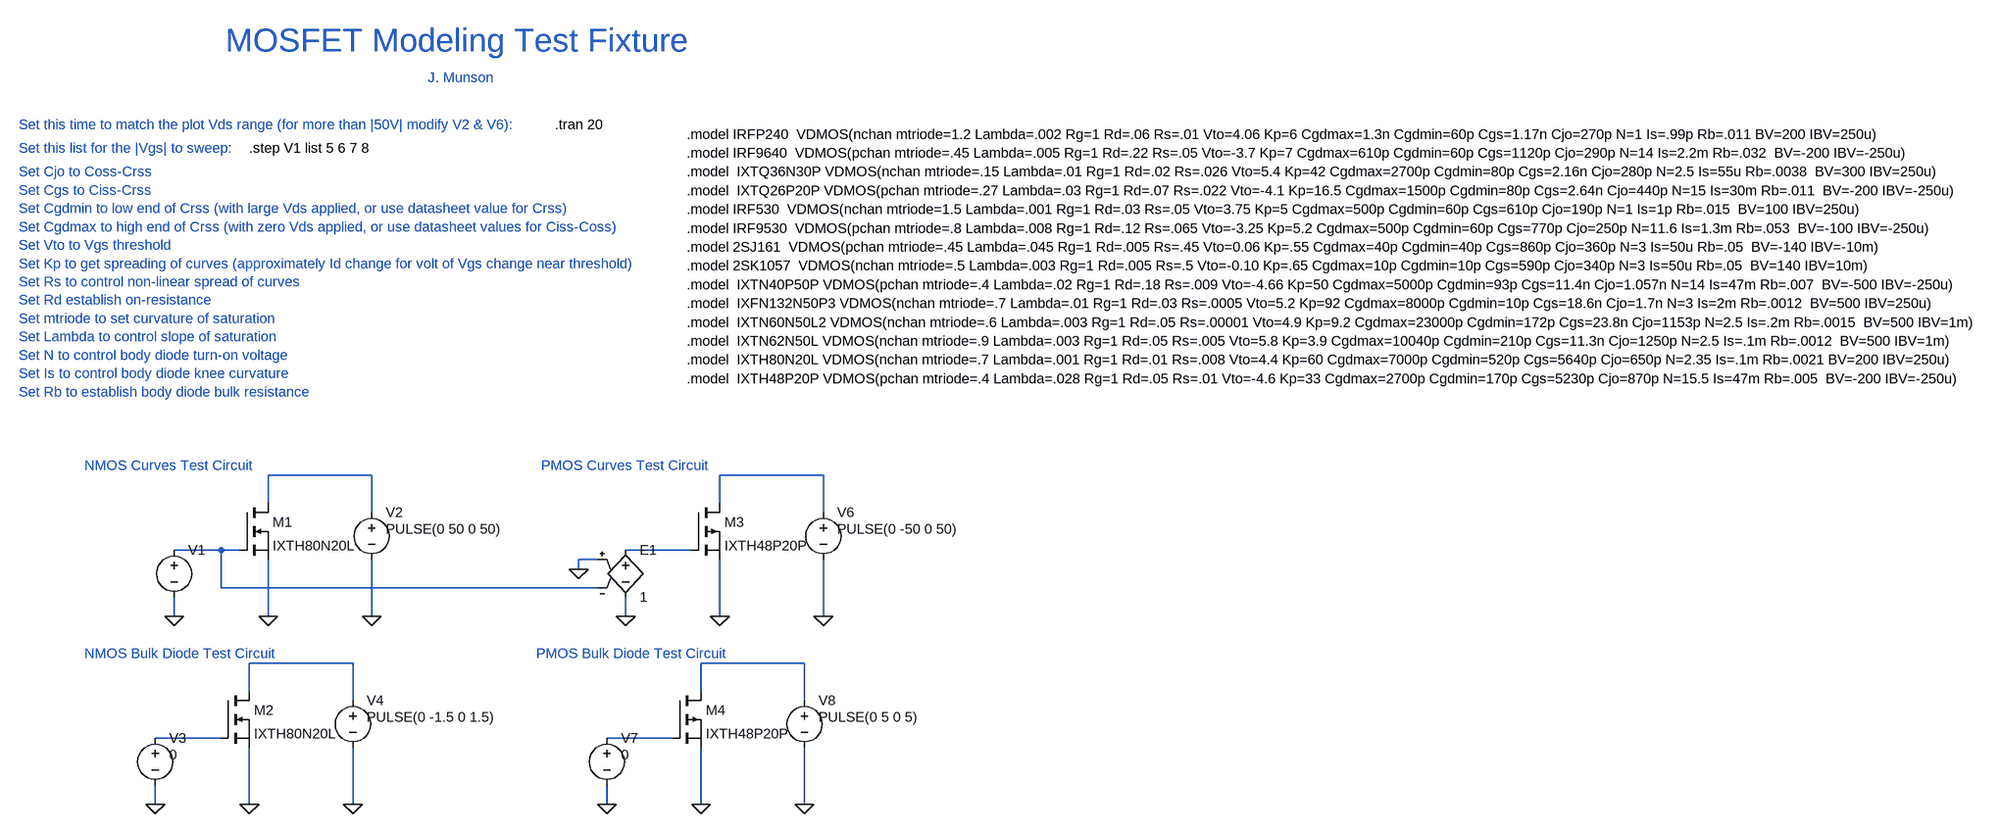
[diagram p0: schematic mosfet_test_circuit.asc]
mosfet_test_circuit.asc, the LTspice schematic file:
Version 4
SHEET 1 3808 824
WIRE 528 -944 352 -944
WIRE 1296 -944 1120 -944
WIRE 352 -896 352 -944
WIRE 1120 -896 1120 -944
WIRE 528 -880 528 -944
WIRE 1296 -880 1296 -944
WIRE 272 -816 192 -816
WIRE 304 -816 272 -816
WIRE 1072 -816 960 -816
WIRE 912 -800 880 -800
WIRE 880 -784 880 -800
WIRE 272 -752 272 -816
WIRE 912 -752 272 -752
WIRE 192 -704 192 -736
WIRE 352 -704 352 -800
WIRE 528 -704 528 -800
WIRE 960 -704 960 -736
WIRE 1120 -704 1120 -800
WIRE 1296 -704 1296 -800
WIRE 496 -624 320 -624
WIRE 1264 -624 1088 -624
WIRE 320 -576 320 -624
WIRE 1088 -576 1088 -624
WIRE 496 -560 496 -624
WIRE 1264 -560 1264 -624
WIRE 272 -496 160 -496
WIRE 1040 -496 928 -496
WIRE 160 -384 160 -416
WIRE 320 -384 320 -480
WIRE 496 -384 496 -480
WIRE 928 -384 928 -416
WIRE 1088 -384 1088 -480
WIRE 1264 -384 1264 -480
FLAG 192 -704 0
FLAG 528 -704 0
FLAG 352 -704 0
FLAG 160 -384 0
FLAG 496 -384 0
FLAG 320 -384 0
FLAG 960 -704 0
FLAG 1296 -704 0
FLAG 1120 -704 0
FLAG 928 -384 0
FLAG 1264 -384 0
FLAG 1088 -384 0
FLAG 880 -784 0
SYMBOL voltage 192 -832 R0
WINDOW 123 0 0 Left 2
WINDOW 39 0 0 Left 2
SYMATTR InstName V1
SYMATTR Value ""
SYMBOL voltage 528 -896 R0
WINDOW 3 24 44 Left 2
WINDOW 123 0 0 Left 2
WINDOW 39 0 0 Left 2
SYMATTR Value PULSE(0 50 0 50)
SYMATTR InstName V2
SYMBOL voltage 160 -512 R0
WINDOW 123 0 0 Left 2
WINDOW 39 0 0 Left 2
WINDOW 3 24 44 Left 2
SYMATTR Value 0
SYMATTR InstName V3
SYMBOL voltage 496 -576 R0
WINDOW 3 24 44 Left 2
WINDOW 123 0 0 Left 2
WINDOW 39 0 0 Left 2
SYMATTR Value PULSE(0 -1.5 0 1.5)
SYMATTR InstName V4
SYMBOL voltage 1296 -896 R0
WINDOW 3 24 44 Left 2
WINDOW 123 0 0 Left 2
WINDOW 39 0 0 Left 2
SYMATTR Value PULSE(0 -50 0 50)
SYMATTR InstName V6
SYMBOL voltage 928 -512 R0
WINDOW 123 0 0 Left 2
WINDOW 39 0 0 Left 2
WINDOW 3 24 44 Left 2
SYMATTR Value 0
SYMATTR InstName V7
SYMBOL voltage 1264 -576 R0
WINDOW 3 24 44 Left 2
WINDOW 123 0 0 Left 2
WINDOW 39 0 0 Left 2
SYMATTR Value PULSE(0 5 0 5)
SYMATTR InstName V8
SYMBOL pmos 1072 -896 R0
SYMATTR InstName M3
SYMATTR Value IXTH48P20P
SYMBOL pmos 1040 -576 R0
SYMATTR InstName M4
SYMATTR Value IXTH48P20P
SYMBOL e 960 -832 R0
SYMATTR InstName E1
SYMATTR Value 1
SYMBOL nmos 304 -896 R0
SYMATTR InstName M1
SYMATTR Value IXTH80N20L
SYMBOL nmos 272 -576 R0
SYMATTR InstName M2
SYMATTR Value IXTH80N20L
TEXT 40 -960 Left 2 ;NMOS Curves Test Circuit
TEXT 1064 -1288 Left 2 !.model  IXTN40P50P VDMOS(pchan mtriode=.4 Lambda=.02 Rg=1 Rd=.18 Rs=.009 Vto=-4.66 Kp=50 Cgdmax=5000p Cgdmin=93p Cgs=11.4n Cjo=1.057n N=14 Is=47m Rb=.007  BV=-500 IBV=-250u)
TEXT 320 -1520 Left 2 !.step V1 list 5 6 7 8
TEXT 840 -1560 Left 2 !.tran 20
TEXT 40 -640 Left 2 ;NMOS Bulk Diode Test Circuit
TEXT 1064 -1256 Left 2 !.model  IXFN132N50P3 VDMOS(nchan mtriode=.7 Lambda=.01 Rg=1 Rd=.03 Rs=.0005 Vto=5.2 Kp=92 Cgdmax=8000p Cgdmin=10p Cgs=18.6n Cjo=1.7n N=3 Is=2m Rb=.0012  BV=500 IBV=250u)
TEXT 1064 -1224 Left 2 !.model  IXTN60N50L2 VDMOS(nchan mtriode=.6 Lambda=.003 Rg=1 Rd=.05 Rs=.00001 Vto=4.9 Kp=9.2 Cgdmax=23000p Cgdmin=172p Cgs=23.8n Cjo=1153p N=2.5 Is=.2m Rb=.0015  BV=500 IBV=1m)
TEXT 1064 -1352 Left 2 !.model 2SJ161  VDMOS(pchan mtriode=.45 Lambda=.045 Rg=1 Rd=.005 Rs=.45 Vto=0.06 Kp=.55 Cgdmax=40p Cgdmin=40p Cgs=860p Cjo=360p N=3 Is=50u Rb=.05  BV=-140 IBV=-10m)
TEXT 816 -960 Left 2 ;PMOS Curves Test Circuit
TEXT 808 -640 Left 2 ;PMOS Bulk Diode Test Circuit
TEXT 1064 -1384 Left 2 !.model IRF9530  VDMOS(pchan mtriode=.8 Lambda=.008 Rg=1 Rd=.12 Rs=.065 Vto=-3.25 Kp=5.2 Cgdmax=500p Cgdmin=60p Cgs=770p Cjo=250p N=11.6 Is=1.3m Rb=.053  BV=-100 IBV=-250u)
TEXT 1064 -1416 Left 2 !.model IRF530  VDMOS(nchan mtriode=1.5 Lambda=.001 Rg=1 Rd=.03 Rs=.05 Vto=3.75 Kp=5 Cgdmax=500p Cgdmin=60p Cgs=610p Cjo=190p N=1 Is=1p Rb=.015  BV=100 IBV=250u)
TEXT 1064 -1448 Left 2 !.model  IXTQ26P20P VDMOS(pchan mtriode=.27 Lambda=.03 Rg=1 Rd=.07 Rs=.022 Vto=-4.1 Kp=16.5 Cgdmax=1500p Cgdmin=80p Cgs=2.64n Cjo=440p N=15 Is=30m Rb=.011  BV=-200 IBV=-250u)
TEXT 1064 -1320 Left 2 !.model 2SK1057  VDMOS(nchan mtriode=.5 Lambda=.003 Rg=1 Rd=.005 Rs=.5 Vto=-0.10 Kp=.65 Cgdmax=10p Cgdmin=10p Cgs=590p Cjo=340p N=3 Is=50u Rb=.05  BV=140 IBV=10m)
TEXT 1064 -1480 Left 2 !.model  IXTQ36N30P VDMOS(nchan mtriode=.15 Lambda=.01 Rg=1 Rd=.02 Rs=.026 Vto=5.4 Kp=42 Cgdmax=2700p Cgdmin=80p Cgs=2.16n Cjo=280p N=2.5 Is=55u Rb=.0038  BV=300 IBV=250u)
TEXT 1064 -1512 Left 2 !.model IRF9640  VDMOS(pchan mtriode=.45 Lambda=.005 Rg=1 Rd=.22 Rs=.05 Vto=-3.7 Kp=7 Cgdmax=610p Cgdmin=60p Cgs=1120p Cjo=290p N=14 Is=2.2m Rb=.032  BV=-200 IBV=-250u)
TEXT 1064 -1544 Left 2 !.model IRFP240  VDMOS(nchan mtriode=1.2 Lambda=.002 Rg=1 Rd=.06 Rs=.01 Vto=4.06 Kp=6 Cgdmax=1.3n Cgdmin=60p Cgs=1.17n Cjo=270p N=1 Is=.99p Rb=.011 BV=200 IBV=250u)
TEXT 1064 -1192 Left 2 !.model  IXTN62N50L VDMOS(nchan mtriode=.9 Lambda=.003 Rg=1 Rd=.05 Rs=.005 Vto=5.8 Kp=3.9 Cgdmax=10040p Cgdmin=210p Cgs=11.3n Cjo=1250p N=2.5 Is=.1m Rb=.0012  BV=500 IBV=1m)
TEXT -72 -1560 Left 2 ;Set this time to match the plot Vds range (for more than |50V| modify V2 & V6):
TEXT -72 -1520 Left 2 ;Set this list for the |Vgs| to sweep:
TEXT -72 -1480 Left 2 ;Set Cjo to Coss-Crss\nSet Cgs to Ciss-Crss\nSet Cgdmin to low end of Crss (with large Vds applied, or use datasheet value for Crss)\nSet Cgdmax to high end of Crss (with zero Vds applied, or use datasheet values for Ciss-Coss)\nSet Vto to Vgs threshold\nSet Kp to get spreading of curves (approximately Id change for volt of Vgs change near threshold)\nSet Rs to control non-linear spread of curves\nSet Rd establish on-resistance\nSet mtriode to set curvature of saturation\nSet Lambda to control slope of saturation\nSet N to control body diode turn-on voltage\nSet Is to control body diode knee curvature\nSet Rb to establish body diode bulk resistance
TEXT 280 -1704 Left 5 ;MOSFET Modeling Test Fixture
TEXT 624 -1640 Left 2 ;J. Munson
TEXT 1064 -1160 Left 2 !.model  IXTH80N20L VDMOS(nchan mtriode=.7 Lambda=.001 Rg=1 Rd=.01 Rs=.008 Vto=4.4 Kp=60 Cgdmax=7000p Cgdmin=520p Cgs=5640p Cjo=650p N=2.35 Is=.1m Rb=.0021 BV=200 IBV=250u)
TEXT 1064 -1128 Left 2 !.model  IXTH48P20P VDMOS(pchan mtriode=.4 Lambda=.028 Rg=1 Rd=.05 Rs=.01 Vto=-4.6 Kp=33 Cgdmax=2700p Cgdmin=170p Cgs=5230p Cjo=870p N=15.5 Is=47m Rb=.005  BV=-200 IBV=-250u)

The netlist it stands for:
* mosfet_test_circuit.asc
V1 N003 0
V2 N001 0 PULSE(0 50 0 50)
V3 N007 0 0
V4 N005 0 PULSE(0 -1.5 0 1.5)
V6 N002 0 PULSE(0 -50 0 50)
V7 N008 0 0
V8 N006 0 PULSE(0 5 0 5)
M3 N002 N004 0 0 IXTH48P20P
M4 N006 N008 0 0 IXTH48P20P
E1 N004 0 0 N003 1
M1 N001 N003 0 0 IXTH80N20L
M2 N005 N007 0 0 IXTH80N20L
.model NMOS NMOS
.model PMOS PMOS
.lib standard.mos
* NMOS Curves Test Circuit
.model  IXTN40P50P VDMOS(pchan mtriode=.4 Lambda=.02 Rg=1 Rd=.18 Rs=.009 Vto=-4.66 Kp=50 Cgdmax=5000p Cgdmin=93p Cgs=11.4n Cjo=1.057n N=14 Is=47m Rb=.007  BV=-500 IBV=-250u)
.step V1 list 5 6 7 8
.tran 20
* NMOS Bulk Diode Test Circuit
.model  IXFN132N50P3 VDMOS(nchan mtriode=.7 Lambda=.01 Rg=1 Rd=.03 Rs=.0005 Vto=5.2 Kp=92 Cgdmax=8000p Cgdmin=10p Cgs=18.6n Cjo=1.7n N=3 Is=2m Rb=.0012  BV=500 IBV=250u)
.model  IXTN60N50L2 VDMOS(nchan mtriode=.6 Lambda=.003 Rg=1 Rd=.05 Rs=.00001 Vto=4.9 Kp=9.2 Cgdmax=23000p Cgdmin=172p Cgs=23.8n Cjo=1153p N=2.5 Is=.2m Rb=.0015  BV=500 IBV=1m)
.model 2SJ161  VDMOS(pchan mtriode=.45 Lambda=.045 Rg=1 Rd=.005 Rs=.45 Vto=0.06 Kp=.55 Cgdmax=40p Cgdmin=40p Cgs=860p Cjo=360p N=3 Is=50u Rb=.05  BV=-140 IBV=-10m)
* PMOS Curves Test Circuit
* PMOS Bulk Diode Test Circuit
.model IRF9530  VDMOS(pchan mtriode=.8 Lambda=.008 Rg=1 Rd=.12 Rs=.065 Vto=-3.25 Kp=5.2 Cgdmax=500p Cgdmin=60p Cgs=770p Cjo=250p N=11.6 Is=1.3m Rb=.053  BV=-100 IBV=-250u)
.model IRF530  VDMOS(nchan mtriode=1.5 Lambda=.001 Rg=1 Rd=.03 Rs=.05 Vto=3.75 Kp=5 Cgdmax=500p Cgdmin=60p Cgs=610p Cjo=190p N=1 Is=1p Rb=.015  BV=100 IBV=250u)
.model  IXTQ26P20P VDMOS(pchan mtriode=.27 Lambda=.03 Rg=1 Rd=.07 Rs=.022 Vto=-4.1 Kp=16.5 Cgdmax=1500p Cgdmin=80p Cgs=2.64n Cjo=440p N=15 Is=30m Rb=.011  BV=-200 IBV=-250u)
.model 2SK1057  VDMOS(nchan mtriode=.5 Lambda=.003 Rg=1 Rd=.005 Rs=.5 Vto=-0.10 Kp=.65 Cgdmax=10p Cgdmin=10p Cgs=590p Cjo=340p N=3 Is=50u Rb=.05  BV=140 IBV=10m)
.model  IXTQ36N30P VDMOS(nchan mtriode=.15 Lambda=.01 Rg=1 Rd=.02 Rs=.026 Vto=5.4 Kp=42 Cgdmax=2700p Cgdmin=80p Cgs=2.16n Cjo=280p N=2.5 Is=55u Rb=.0038  BV=300 IBV=250u)
.model IRF9640  VDMOS(pchan mtriode=.45 Lambda=.005 Rg=1 Rd=.22 Rs=.05 Vto=-3.7 Kp=7 Cgdmax=610p Cgdmin=60p Cgs=1120p Cjo=290p N=14 Is=2.2m Rb=.032  BV=-200 IBV=-250u)
.model IRFP240  VDMOS(nchan mtriode=1.2 Lambda=.002 Rg=1 Rd=.06 Rs=.01 Vto=4.06 Kp=6 Cgdmax=1.3n Cgdmin=60p Cgs=1.17n Cjo=270p N=1 Is=.99p Rb=.011 BV=200 IBV=250u)
.model  IXTN62N50L VDMOS(nchan mtriode=.9 Lambda=.003 Rg=1 Rd=.05 Rs=.005 Vto=5.8 Kp=3.9 Cgdmax=10040p Cgdmin=210p Cgs=11.3n Cjo=1250p N=2.5 Is=.1m Rb=.0012  BV=500 IBV=1m)
* Set this time to match the plot Vds range (for more than |50V| modify V2 & V6):
* Set this list for the |Vgs| to sweep:
* Set Cjo to Coss-Crss
* Set Cgs to Ciss-Crss
* Set Cgdmin to low end of Crss (with large Vds applied, or use datasheet value for Crss)
* Set Cgdmax to high end of Crss (with zero Vds applied, or use datasheet values for Ciss-Coss)
* Set Vto to Vgs threshold
* Set Kp to get spreading of curves (approximately Id change for volt of Vgs change near threshold)
* Set Rs to control non-linear spread of curves
* Set Rd establish on-resistance
* Set mtriode to set curvature of saturation
* Set Lambda to control slope of saturation
* Set N to control body diode turn-on voltage
* Set Is to control body diode knee curvature
* Set Rb to establish body diode bulk resistance
* MOSFET Modeling Test Fixture
* J. Munson
.model  IXTH80N20L VDMOS(nchan mtriode=.7 Lambda=.001 Rg=1 Rd=.01 Rs=.008 Vto=4.4 Kp=60 Cgdmax=7000p Cgdmin=520p Cgs=5640p Cjo=650p N=2.35 Is=.1m Rb=.0021 BV=200 IBV=250u)
.model  IXTH48P20P VDMOS(pchan mtriode=.4 Lambda=.028 Rg=1 Rd=.05 Rs=.01 Vto=-4.6 Kp=33 Cgdmax=2700p Cgdmin=170p Cgs=5230p Cjo=870p N=15.5 Is=47m Rb=.005  BV=-200 IBV=-250u)
.backanno
.end